# Altium project Mirny.PrjPCB (part 3 of 4)

## Sheet CLK_INPUT.SchDoc: Clock distribution
size 420 x 297 mm; Author: K.B.; CompanyName: WUT; DrawnBy: K.B.; Organization: WUT ISE; Address1: Warsaw Univeristy of Technology; Address2: Nowowiejska 15/19; DocumentNumber: 7; Revision: 1.1.4; SheetNumber: 4; SheetTotal: 10; EDA_Number: ARTIQ; Projet: ARTIQ/SINARA; ModifiedBy: -; CreateDate: XX/XX/XXXX; CheckedDate: -; Title2: and generation; DivGrp: ISE; Designer: K.B.; ModifiedDate: -; ProjectName: ARTIQ/SINARA
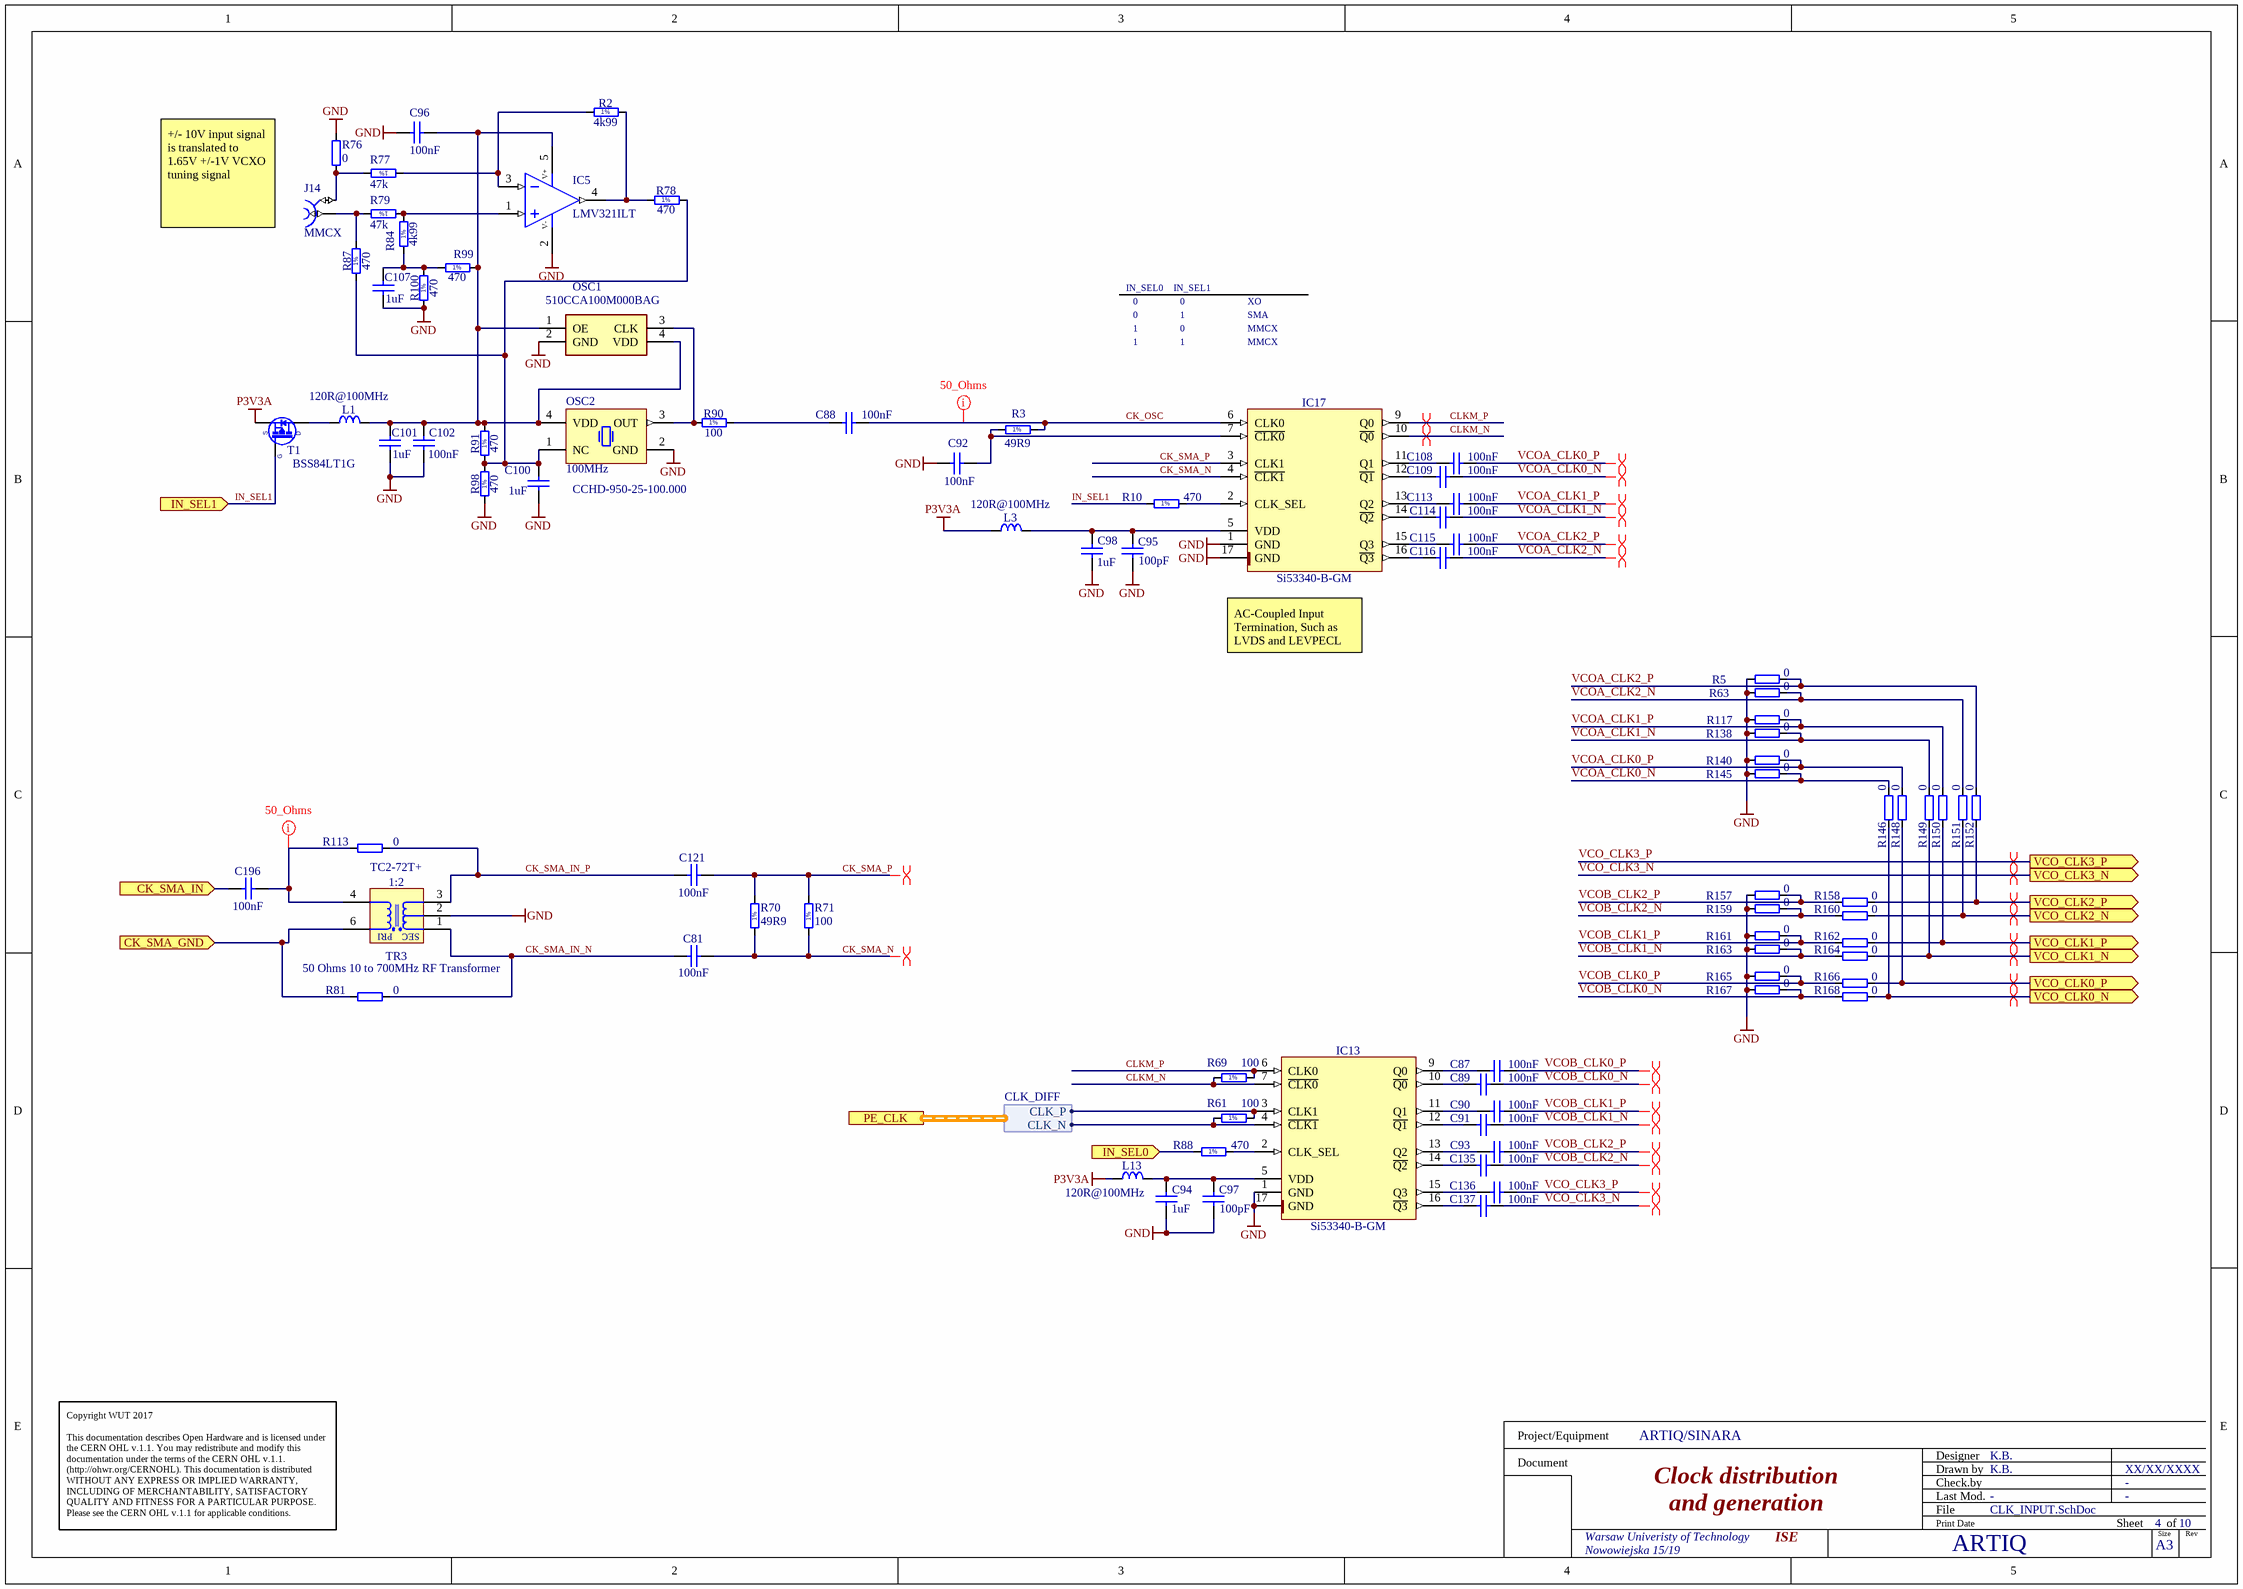
[diagram p5: CLK_INPUT.SchDoc]

### Parts
C81  100nF  [CAPC1005X55N]
C87  100nF  [CAPC1005X55N]
C88  100nF  [CAPC1005X55N]
C89  100nF  [CAPC1005X55N]
C90  100nF  [CAPC1005X55N]
C91  100nF  [CAPC1005X55N]
C92  100nF  [CAPC1005X55N]
C93  100nF  [CAPC1005X55N]
C94  1uF  [CAPC1005X55N]
C95  100pF  [CAPC1005X55N]
C96  100nF  [CAPC1005X55N]
C97  100pF  [CAPC1005X55N]
C98  1uF  [CAPC1005X55N]
C100  1uF  [CAPC1005X55N]
C101  1uF  [CAPC1005X55N]
C102  100nF  [CAPC1005X55N]
C107  1uF  [CAPC1005X55N]
C108  100nF  [CAPC1005X55N]
C109  100nF  [CAPC1005X55N]
C113  100nF  [CAPC1005X55N]
C114  100nF  [CAPC1005X55N]
C115  100nF  [CAPC1005X55N]
C116  100nF  [CAPC1005X55N]
C121  100nF  [CAPC1005X55N]
C135  100nF  [CAPC1005X55N]
C136  100nF  [CAPC1005X55N]
C137  100nF  [CAPC1005X55N]
C196  100nF  [CAPC1005X55N]
IC5  LMV321ILT  [SOT95P280X145-5N]
IC13  Si53340-B-GM  [QFN50P300X300X90-17N-S175]
IC17  Si53340-B-GM  [QFN50P300X300X90-17N-S175]
J14  MMCX  [SAMTEC_MMCX-J-P-H-ST-TH1]
L1  120R@100MHz  [INDC1608X95N]
L3  120R@100MHz  [INDC1608X95N]
L13  120R@100MHz  [INDC1608X95N]
OSC1  510CCA100M000BAG  [510CBA49M1520BAG]
OSC2  100MHz  Manufacturer Part Number: CCHD-950-25-100.000  [OSC_CRYSTEK_CCHD-950]
R2  4k99  [RESC1608X55N]
R3  49R9  [RESC1005X40N]
R5  0  [RESC1005X40N]
R10  470  [RESC1005X40N]
R61  100  [RESC1005X40N]
R63  0  [RESC1005X40N]
R69  100  [RESC1005X40N]
R70  49R9  [RESC1005X40N]
R71  100  [RESC1005X40N]
R76  0  [RESC1005X40N]
R77  47k  [RESC1608X55N]
R78  470  [RESC1608X55N]
R79  47k  [RESC1608X55N]
R81  0  [RESC1005X40N]
R84  4k99  [RESC1608X55N]
R87  470  [RESC1608X55N]
R88  470  [RESC1005X40N]
R90  100  [RESC1005X40N]
R91  470  [RESC1608X55N]
R98  470  [RESC1608X55N]
R99  470  [RESC1608X55N]
R100  470  [RESC1608X55N]
R113  0  [RESC1005X40N]
R117  0  [RESC1005X40N]
R138  0  [RESC1005X40N]
R140  0  [RESC1005X40N]
R145  0  [RESC1005X40N]
R146  0  [RESC1005X40N]
R148  0  [RESC1005X40N]
R149  0  [RESC1005X40N]
R150  0  [RESC1005X40N]
R151  0  [RESC1005X40N]
R152  0  [RESC1005X40N]
R157  0  [RESC1005X40N]
R158  0  [RESC1005X40N]
R159  0  [RESC1005X40N]
R160  0  [RESC1005X40N]
R161  0  [RESC1005X40N]
R162  0  [RESC1005X40N]
R163  0  [RESC1005X40N]
R164  0  [RESC1005X40N]
R165  0  [RESC1005X40N]
R166  0  [RESC1005X40N]
R167  0  [RESC1005X40N]
R168  0  [RESC1005X40N]
T1  BSS84LT1G  [SOT95P240X110-3N]
TR3  1:2  Manufacturer Part Number: TC2-72T+  Part Description: 50 Ohms 10 to 700MHz RF Transformer  [XFMR_MINI-CIRCUITS_AT1521]

### Ports
CK_SMA_GND (in), CK_SMA_IN (in), IN_SEL0 (in), IN_SEL1 (in), PE_CLK (harness CLK_DIFF), VCO_CLK0_N (out), VCO_CLK0_P (out), VCO_CLK1_N (out), VCO_CLK1_P (out), VCO_CLK2_N (out), VCO_CLK2_P (out), VCO_CLK3_N (out), VCO_CLK3_P (out)

### Harnesses
CLK_DIFF: CLK_N, CLK_P

### Nets
GND: C92.1 C94.1 C95.1 C96.1 C97.1 C98.1 C100.1 C101.1 C102.1 C107.1 IC5.2(V-) IC13.1(GND) IC13.17(GND) IC17.1(GND) IC17.17(GND) OSC1.2(GND) OSC2.2(GND) R5.1 R63.1 R76.2 R98.1 R100.1 R117.1 R138.1 R140.1 R145.1 R157.1 R159.1 R161.1 R163.1 R165.1 R167.1 TR3.2(NC)
P3V3A: L3.2 L13.2 T1.2(S)
CK_OSC: C88.2 IC17.6(CLK0) R3.2
CK_SMA_IN_N: C81.1 R81.2 TR3.1(SDOT)
CK_SMA_IN_P: C121.1 R113.2 TR3.3(S)
CK_SMA_N: C81.2 IC17.4(~{CLK1}) R70.1 R71.1
CK_SMA_P: C121.2 IC17.3(CLK1) R70.2 R71.2
CLKM_N: IC13.7(~{CLK0}) IC17.10(~{Q0}) R69.1
CLKM_P: IC13.6(CLK0) IC17.9(Q0) R69.2
IN_SEL0: R88.1 ; port IN_SEL0
IN_SEL1: R10.1 T1.1(G) ; port IN_SEL1
SG0: R81.1 TR3.6(PDOT) ; port CK_SMA_GND
VCO_CLK0_N: R146.1 R168.2 ; port VCO_CLK0_N
VCO_CLK0_P: R148.1 R166.2 ; port VCO_CLK0_P
VCO_CLK1_N: R149.1 R164.2 ; port VCO_CLK1_N
VCO_CLK1_P: R150.1 R162.2 ; port VCO_CLK1_P
VCO_CLK2_N: R151.1 R160.2 ; port VCO_CLK2_N
VCO_CLK2_P: R152.1 R158.2 ; port VCO_CLK2_P
VCO_CLK3_N: C137.1 ; port VCO_CLK3_N
VCO_CLK3_P: C136.1 ; port VCO_CLK3_P
VCOA_CLK0_N: C109.1 R145.2 R146.2
VCOA_CLK0_P: C108.1 R140.2 R148.2
VCOA_CLK1_N: C114.1 R138.2 R149.2
VCOA_CLK1_P: C113.1 R117.2 R150.2
VCOA_CLK2_N: C116.1 R63.2 R151.2
VCOA_CLK2_P: C115.1 R5.2 R152.2
VCOB_CLK0_N: C89.1 R167.2 R168.1
VCOB_CLK0_P: C87.1 R165.2 R166.1
VCOB_CLK1_N: C91.1 R163.2 R164.1
VCOB_CLK1_P: C90.1 R161.2 R162.1
VCOB_CLK2_N: C135.1 R159.2 R160.1
VCOB_CLK2_P: C93.1 R157.2 R158.1
NetC87_2: C87.2 IC13.9(Q0)
NetC88_1: C88.1 R90.2
NetC89_2: C89.2 IC13.10(~{Q0})
NetC90_2: C90.2 IC13.11(Q1)
NetC91_2: C91.2 IC13.12(~{Q1})
NetC92_2: C92.2 IC17.7(~{CLK0}) R3.1
NetC93_2: C93.2 IC13.13(Q2)
NetC94_2: C94.2 C97.2 IC13.5(VDD) L13.1
NetC95_2: C95.2 C98.2 IC17.5(VDD) L3.1
NetC96_2: C96.2 C101.2 C102.2 IC5.5(V+) L1.1 OSC1.1(OE) OSC1.4(VDD) OSC2.4(VDD) R91.2 R99.2
NetC100_2: C100.2 OSC2.1(NC) R78.2 R87.1 R91.1 R98.2
NetC107_2: C107.2 R84.1 R99.1 R100.2
NetC108_2: C108.2 IC17.11(Q1)
NetC109_2: C109.2 IC17.12(~{Q1})
NetC113_2: C113.2 IC17.13(Q2)
NetC114_2: C114.2 IC17.14(~{Q2})
NetC115_2: C115.2 IC17.15(Q3)
NetC116_2: C116.2 IC17.16(~{Q3})
NetC135_2: C135.2 IC13.14(~{Q2})
NetC136_2: C136.2 IC13.15(Q3)
NetC137_2: C137.2 IC13.16(~{Q3})
NetC196_1: C196.1 ; port CK_SMA_IN
NetC196_2: C196.2 R113.1 TR3.4(P)
NetIC5_1: IC5.1(IN+) R79.1 R84.2
NetIC5_3: IC5.3(IN-) R2.1 R77.1
NetIC5_4: IC5.4(OUT) R2.2 R78.1
NetIC13_2: IC13.2(CLK_SEL) R88.2
NetIC13_3: IC13.3(CLK1) R61.2 ; port PE_CLK.CLK_P
NetIC13_4: IC13.4(~{CLK1}) R61.1 ; port PE_CLK.CLK_N
NetIC17_2: IC17.2(CLK_SEL) R10.2
NetJ14_1: J14.1 R79.2 R87.2
NetJ14_2: J14.2 R76.1 R77.2
NetL1_2: L1.2 T1.3(D)
NetOSC1_3: OSC1.3(CLK) OSC2.3(OUT) R90.1

### Layout directives
net class 50_Ohms: CK_OSC, NetC196_2
differential pair: CK_SMA_N, CK_SMA_P, CLKM_N, CLKM_P, VCO_CLK0_N, VCO_CLK0_P, VCO_CLK1_N, VCO_CLK1_P, VCO_CLK2_N, VCO_CLK2_P, VCO_CLK3_N, VCO_CLK3_P, VCOA_CLK0_N, VCOA_CLK0_P, VCOA_CLK1_N, VCOA_CLK1_P, VCOA_CLK2_N, VCOA_CLK2_P, VCOB_CLK0_N, VCOB_CLK0_P, VCOB_CLK1_N, VCOB_CLK1_P, VCOB_CLK2_N, VCOB_CLK2_P

### Notes on the sheet
- (near J14) +/- 10V input signal is translated to 1.65V +/-1V VCXO tuning signal
- IN_SEL0
- 0
- IN_SEL1
- 1
- XO
- SMA
- MMCX
- (near IC17) AC-Coupled Input Termination, Such as LVDS and LEVPECL
- Copyright WUT 2017
  This documentation describes Open Hardware and is licensed under the CERN OHL v.1.1. You may redistribute and modify this documentation under the terms of the CERN OHL v.1.1. (http://ohwr.org/CERNOHL). This documentation is distributed WITHOUT ANY EXPRESS OR IMPLIED WARRANTY, INCLUDING OF MERCHANTABILITY, SATISFACTORY QUALITY AND FITNESS FOR A PARTICULAR PURPOSE. Please see the CERN OHL v.1.1 for applicable conditions.
- Project/Equipment
- Document
- Designer
- Drawn by
- Check.by
- File
- Last Mod.
- Print Date
- Sheet
- Size
- A3
- of
- Rev
- (in symbol R0402_49R9_1%_0.0625W_100PPM) 1%
- (in symbol R0402_100R_1%_0.0625W_100PPM) 1%
- (in symbol R0402_470R_1%_0.0625W_100PPM) 1%
- (in symbol R0603_4K99_1%_0.063W_50PPM) 1%
- (in symbol R0603_47K_1%_0.1W_100PPM) 1%
- (in symbol R0603_470R_1%_0.1W_100PPM) 1%
- (in symbol XFMR_MINI-CIRCUITS_TC2-72T+) PRI; SEC

### Library data of the parts
C81 C87-C93 C96 C102 C108 C109 C113-C116 C121 C135-C137 C196 = CC0402_100NF_16V_10%_X5R: Non-polarised capacitor; Part Description: SMD Multilayer Chip Ceramic Capacitor; Manufacturer: GENERIC; Manufacturer1 Part Number: GRM155R61C104KA88D; Voltage: 16V; TC: X5R; Tolerance: ±10%; Part Number: CC0402_100NF_16V_10%_X5R; Component Kind: Standard; Component Type: Standard; Pin Count: 2; Value: 100nF; Status: None; Manufacturer Part Number: CC0402_100NF_16V_10%_X5R; Case: 0402; Mounted: Yes; Socket: No; SMD: Yes; Sense: No; Manufacturer1 Example: MURATA; Manufacturer1 ComponentHeight: 0.55mm; HelpURL: \\cern.ch\dfs\Applications\Altium\Datasheets\CC0402_X5R_MURATA_GRM.pdf; Author: CERN DEM JLC; CreateDate: 10.12.2013; LatestRevisionDate: 10.12.2013
C94 C98 C100 C101 C107 = CC0402_1UF_16V_10%_X5R: Non-polarised capacitor; Part Description: SMD Multilayer Chip Ceramic Capacitor; Manufacturer: GENERIC; Manufacturer1 Part Number: C1005X5R1C105KT; Voltage: 16V; TC: X5R; Tolerance: ±10%; Part Number: CC0402_1UF_16V_10%_X5R; Component Kind: Standard; Component Type: Standard; Pin Count: 2; Value: 1uF; Status: Preferred; Manufacturer Part Number: CC0402_1UF_16V_10%_X5R; Case: 0402; Mounted: Yes; Socket: No; SMD: Yes; Sense: No; Manufacturer1 Example: TDK; Manufacturer1 ComponentHeight: 0.55mm; HelpURL: \\cern.ch\dfs\Applications\Altium\Datasheets\CC0402_X5R_TDK_C.pdf; Author: CERN DEM JLC; CreateDate: 2012-10-25; LatestRevisionDate: 2012-10-25
C95 C97 = CC0402_100PF_50V_5%_C0G: Non-polarised capacitor; Part Description: SMD Multilayer Chip Ceramic Capacitor; Manufacturer: GENERIC; Manufacturer1 Part Number: C0402C101J5GACTU; Voltage: 50V; TC: C0G/NP0; Tolerance: ±5%; Part Number: CC0402_100PF_50V_5%_C0G; Component Kind: Standard; Component Type: Standard; Pin Count: 2; Value: 100pF; Status: Preferred; Manufacturer Part Number: CC0402_100PF_50V_5%_C0G; Case: 0402; Mounted: Yes; Socket: No; SMD: Yes; Sense: No; Manufacturer1 Example: KEMET; Manufacturer1 ComponentHeight: 0.55mm; HelpURL: \\cern.ch\dfs\Applications\Altium\Datasheets\CC0805_C0G_KEMET_(Commercial Grade).pdf; Author: CERN DEM JLC; CreateDate: 03.12.2007; LatestRevisionDate: 22.04.2015
IC5 = LMV321ILT: Operational Amplifier; Part Description: Low Cost, Low Power, Input/Output Rail-To-Rail Operational Amplifiers; Manufacturer: ST MICROELECTRONICS; PressFit: No; Bonding: No; Part Number: LMV321ILT; Component Kind: Standard; Component Type: Standard; Device: LMV321ILT; PackageDescription: SOT, 0.95mm pitch; 5 pin, 1.60mm W X 2.90mm L X 1.45mm H body, IPC Medium Density; Manufacturer Part Number: LMV321ILT; Pin Count: 5; Case: SOT23-5; Mounted: Yes; Socket: No; SMD: Yes; Sense: No; ComponentHeight: 1.45mm; Author: CERN DEM MR; HelpURL: \\cern.ch\dfs\Applications\Altium\Datasheets\LMV321ILT.pdf; CreateDate: 02/10/2017; LatestRevisionDate: 02/10/2017
IC13 IC17 = Si53340-B-GM: Low-Jitter LVDS Fanout Clock Buffers, 10-Output,  Any-Input, Any-Frequency up to 1250MHz; Manufacturer: SILICON LABS; PressFit: No; Bonding: No; Part Number: Si53340-B-GM; Component Kind: Standard; Component Type: Standard; Device: Si53340-B-GM; PackageDescription: QFN, 0.50mm Pitch, Square; 16 Pin, 3.00mm L X 3.00mm W X 0.90mm H Body (w/thermal tab 1.75mm x 1.75mm), IPC Medium Density; Part Description: Low-Jitter LVDS Fanout Clock Buffers, 10-Output,  Any-Input, Any-Frequency up to 1250MHz; Manufacturer Part Number: Si53340-B-GM; Pin Count: 17; Case: QFN16; Mounted: Yes; Socket: No; SMD: Yes; Sense: No; ComponentHeight: 0.9mm; HelpURL: \\cern.ch\dfs\Applications\Altium\Datasheets\Si53340-B-GM.pdf; Author: CERN DEM MR; CreateDate: 04.09.2017; LatestRevisionDate: 04.09.2017
J14 = SAMTEC_MMCX-J-P-H-ST-TH1: Part Description: Straight Through-hole 50 Ohm Micro Mini RF Jack, MMCX Series; Manufacturer: SAMTEC; PressFit: No; Part Number: SAMTEC_MMCX-J-P-H-ST-TH1; Component Kind: Standard; Component Type: Standard; Pin Count: 2; Mounted: Yes; Socket: No; Sense: No; SMD: No; Status: None; Manufacturer Part Number: MMCX-J-P-H-ST-TH1; ComponentHeight: 4.35mm; HelpURL: \\cern.ch\dfs\Applications\Altium\Datasheets\SAMTEC_MMCX-J-P-H-ST-TH1.pdf; Author: CERN DEM JLC; CreateDate: 05.12.2012; LatestRevisionDate: 05.12.2012
L1 L3 L13 = IND0603_MURATA_BLM18PG121SN1D: Inductor; Part Description: SMD EMIFIL Chip Ferrite Bead; Manufacturer: MURATA; Power: 2A; Resistance: 0.05R; Part Number: IND0603_MURATA_BLM18PG121SN1D; Component Kind: Standard; Component Type: Standard; Pin Count: 2; Value: 120R@100MHz; Status: None; Manufacturer Part Number: BLM18PG121SN1D; Case: 0603; Mounted: Yes; Socket: No; SMD: Yes; Sense: No; ComponentHeight: 0.95mm; HelpURL: \\cern.ch\dfs\Applications\Altium\Datasheets\IND0603_MURATA_BLM18P.pdf; Author: CERN DEM BC; CreateDate: 2015-07-27; LatestRevisionDate: 2015-07-27
OSC1 = 510CCA100M000BAG: Crystal or Oscillator; Manufacturer_Name: Silicon Labs; Datasheet Link: https://www.silabs.com/documents/public/data-sheets/si510-11.pdf; Height: 1mm; Manufacturer_Part_Number: 510CCA100M000BAG; Mouser Part Number: 634-510CCA100M000BAG; Mouser Price/Stock: https://www.mouser.com/Search/Refine.aspx?Keyword=634-510CCA100M000BAG
OSC2 = OSC_CCHD-950: 100MHz low noise oscillator; Part Number: OSC_100MHZ_CRYSTEK_CCHD-950-25-100.000; Part Description: 3.3V, ±25ppm, 0..70°C, CMOS Surface Mount Ultra-Low Noise Oscillator (CCHD-950 Series); Manufacturer: CRYSTEK CRYSTAL; PressFit: No; Bonding: No; Component Kind: Standard; Component Type: Standard; PackageDescription: Oscillator, 5.08mm Pitch; 4 Pin, 14.2mm L X 9.14mm W X 5.3mm H, CCHD-950 Serie; Value: 100MHz; Pin Count: 4; Mounted: Yes; Socket: No; SMD: Yes; Sense: No; ComponentHeight: 5.3mm; HelpURL: \\cern.ch\dfs\Applications\Altium\Datasheets\OSC_CRYSTEK_CVHD-950.pdf; Author: GK; CreateDate: 04.11.2016; LatestRevisionDate: 04.11.2016
R2 R84 = R0603_4K99_1%_0.063W_50PPM: Resistor - 1%; Part Description: General Purpose Thick Film Chip Resistor; Manufacturer: GENERIC; Manufacturer1 Part Number: CPF0603F4K99C1; Power: 0.063W; TC: ±50ppm/°C; PressFit: No; Part Number: R0603_4K99_1%_0.063W_50PPM; Component Kind: Standard; Component Type: Standard; Pin Count: 2; Value: 4k99; Status: None; Tolerance: ±1%; Manufacturer Part Number: R0603_4K99_1%_0.063W_50PPM; Case: 0603; Mounted: Yes; Sense: No; Socket: No; SMD: Yes; Manufacturer1 Example: TYCO NEOHM; Manufacturer1 ComponentHeight: 0.55mm; HelpURL: \\cern.ch\dfs\Applications\Altium\Datasheets\R0603_TYCO_CPF.pdf; Author: CERN DEM JLC; CreateDate: 20.05.2010; LatestRevisionDate: 20.05.2010
R3 R70 = R0402_49R9_1%_0.0625W_100PPM: Resistor - 1%; Part Description: General Purpose Thick Film Chip Resistor; Manufacturer: GENERIC; Manufacturer1 Part Number: 232270674999L or RC0402FR-0749R9L; TC: ±100ppm/°C; PressFit: No; Part Number: R0402_49R9_1%_0.0625W_100PPM; Component Kind: Standard; Component Type: Standard; Pin Count: 2; Value: 49R9; Status: Not Recommended; Power: 0.0625W; Tolerance: ±1%; Manufacturer Part Number: R0402_49R9_1%_0.0625W_100PPM; Case: 0402; Mounted: Yes; Sense: No; Socket: No; SMD: Yes; Manufacturer1 Example: YAGEO PHYCOMP; Manufacturer1 ComponentHeight: 0.4mm; HelpURL: \\cern.ch\dfs\Applications\Altium\Datasheets\R0402_Phycomp_RC0402.pdf; Author: CERN DEM JLC; CreateDate: 24.10.2012; LatestRevisionDate: 24.10.2012
R5 R63 R76 R81 R113 R117 R138 R140 R145 R146 R148-R152 R157-R168 = R0402_0R_JUMPER: Resistor; Part Description: 1A (0.05R Max DC Resistance) Zero Ohm Jumper; Manufacturer: GENERIC; Manufacturer1 Part Number: 232270591001L; PressFit: No; Part Number: R0402_0R_JUMPER; Component Kind: Standard; Component Type: Standard; Pin Count: 2; Value: 0; Status: Not Recommended; Manufacturer Part Number: R0402_0R_JUMPER; Case: 0402; Mounted: Yes; Sense: No; Socket: No; SMD: Yes; Manufacturer1 Example: YAGEO PHYCOMP; Manufacturer1 ComponentHeight: 0.4mm; HelpURL: \\cern.ch\dfs\Applications\Altium\Datasheets\R0402_Phycomp_RC0402.pdf; Author: CERN DEM JLC; CreateDate: 03.12.2007; LatestRevisionDate: 17.10.2012
R10 R88 = R0402_470R_1%_0.0625W_100PPM: Resistor - 1%; Part Description: General Purpose Thick Film Chip Resistor; Manufacturer: GENERIC; Manufacturer1 Part Number: 232270674701L; TC: ±100ppm/°C; PressFit: No; Part Number: R0402_470R_1%_0.0625W_100PPM; Component Kind: Standard; Component Type: Standard; Pin Count: 2; Value: 470; Status: Not Recommended; Power: 0.0625W; Tolerance: ±1%; Manufacturer Part Number: R0402_470R_1%_0.0625W_100PPM; Case: 0402; Mounted: Yes; Sense: No; Socket: No; SMD: Yes; Manufacturer1 Example: YAGEO PHYCOMP; Manufacturer1 ComponentHeight: 0.4mm; HelpURL: \\cern.ch\dfs\Applications\Altium\Datasheets\R0402_Phycomp_RC0402.pdf; Author: CERN DEM JLC; CreateDate: 03.12.2007; LatestRevisionDate: 17.10.2012
R61 R69 R71 R90 = R0402_100R_1%_0.0625W_100PPM: Resistor - 1%; Part Description: General Purpose Thick Film Chip Resistor; Manufacturer: GENERIC; Manufacturer1 Part Number: 232270671001L; TC: ±100ppm/°C; PressFit: No; Part Number: R0402_100R_1%_0.0625W_100PPM; Component Kind: Standard; Component Type: Standard; Pin Count: 2; Value: 100; Status: Not Recommended; Power: 0.0625W; Tolerance: ±1%; Manufacturer Part Number: R0402_100R_1%_0.0625W_100PPM; Case: 0402; Mounted: Yes; Sense: No; Socket: No; SMD: Yes; Manufacturer1 Example: YAGEO PHYCOMP; Manufacturer1 ComponentHeight: 0.4mm; HelpURL: \\cern.ch\dfs\Applications\Altium\Datasheets\R0402_Phycomp_RC0402.pdf; Author: CERN DEM JLC; CreateDate: 03.12.2007; LatestRevisionDate: 17.10.2012
R77 R79 = R0603_47K_1%_0.1W_100PPM: Resistor - 1%; Part Description: General Purpose Thick Film Chip Resistor; Manufacturer: GENERIC; Manufacturer1 Part Number: NRC06F4702TRF; Power: 0.1W; TC: ±100ppm/°C; Part Number: R0603_47K_1%_0.1W_100PPM; Component Kind: Standard; Component Type: Standard; Pin Count: 2; Value: 47k; Status: Preferred; Tolerance: ±1%; Manufacturer Part Number: R0603_47K_1%_0.1W_100PPM; Case: 0603; Mounted: Yes; Sense: No; Socket: No; SMD: Yes; Manufacturer1 Example: NIC COMPONENT; Manufacturer1 ComponentHeight: 0.55mm; HelpURL: \\cern.ch\dfs\Applications\Altium\Datasheets\R0603_NIC_NRC.pdf; Author: CERN DEM JLC; CreateDate: 03.12.2007; LatestRevisionDate: 13.03.2008
R78 R87 R91 R98-R100 = R0603_470R_1%_0.1W_100PPM: Resistor - 1%; Part Description: General Purpose Thick Film Chip Resistor; Manufacturer: GENERIC; Manufacturer1 Part Number: NRC06F4700TRF; Power: 0.1W; TC: ±100ppm/°C; PressFit: No; Part Number: R0603_470R_1%_0.1W_100PPM; Component Kind: Standard; Component Type: Standard; Pin Count: 2; Value: 470; Status: Preferred; Tolerance: ±1%; Manufacturer Part Number: R0603_470R_1%_0.1W_100PPM; Case: 0603; Mounted: Yes; Sense: No; Socket: No; SMD: Yes; Manufacturer1 Example: NIC COMPONENT; Manufacturer1 ComponentHeight: 0.55mm; HelpURL: \\cern.ch\dfs\Applications\Altium\Datasheets\R0603_NIC_NRC.pdf; Author: CERN DEM JLC; CreateDate: 03.12.2007; LatestRevisionDate: 13.03.2008
T1 = BSS84LT1G: P-CHANNEL MOSFET WITH DIODE; Part Description: 50V 130mA Single P-Channel Power MOSFET; Manufacturer: ON SEMICONDUCTOR; PressFit: No; Bonding: No; Part Number: BSS84LT1G; Component Kind: Standard; Component Type: Standard; Device: BSS84LT1G; PackageDescription: SOT23 3-Leads, Pitch 0.95mm - Body 1.4x3mm, IPC Medium Density; Manufacturer Part Number: BSS84LT1G; Pin Count: 3; Case: SOT23-3; Mounted: Yes; Socket: No; SMD: Yes; Sense: No; ComponentHeight: 1.1mm; HelpURL: \\cern.ch\dfs\Applications\Altium\Datasheets\BSS84LT1G.pdf; Author: CERN DEM JLC; CreateDate: 29.03.2012; LatestRevisionDate: 29.03.2012
TR3 = XFMR_MINI-CIRCUITS_TC2-72T+: 50 Ohms 10 to 700 MHzz RF Transformer; Manufacturer: MINI-CIRCUITS; HelpURL: \\cern.ch\dfs\Applications\Altium\Datasheets\XFMR_MINI-CIRCUITS_TC2-1TX+.pdf; Part Number: XFMR_MINI-CIRCUITS_TC2-72T+; Component Kind: Standard; Component Type: Standard; Pin Count: 5; Value: 1:2; Status: None; Mounted: Yes; Socket: No; Sense: No; SMD: Yes; ComponentHeight: 4.06mm; Author: GK; CreateDate: 18.10.2019; LatestRevisionDate: 18.10.2019

## Sheet B2B_connectors.SchDoc: AFE Mezzanine
size 420 x 297 mm; Author: K.B.; CompanyName: WUT; DrawnBy: K.B.; Organization: WUT ISE; Address1: Warsaw Univeristy of Technology; Address2: Nowowiejska 15/19; DocumentNumber: 8; Revision: 1.1.4; SheetNumber: 6; SheetTotal: 12; EDA_Number: ARTIQ; Projet: ARTIQ/SINARA; ModifiedBy: -; CreateDate: XX/XX/XXXX; CheckedDate: -; Title2: Connectors; DivGrp: ISE; Designer: K.B.; ModifiedDate: -; ProjectName: ARTIQ/SINARA
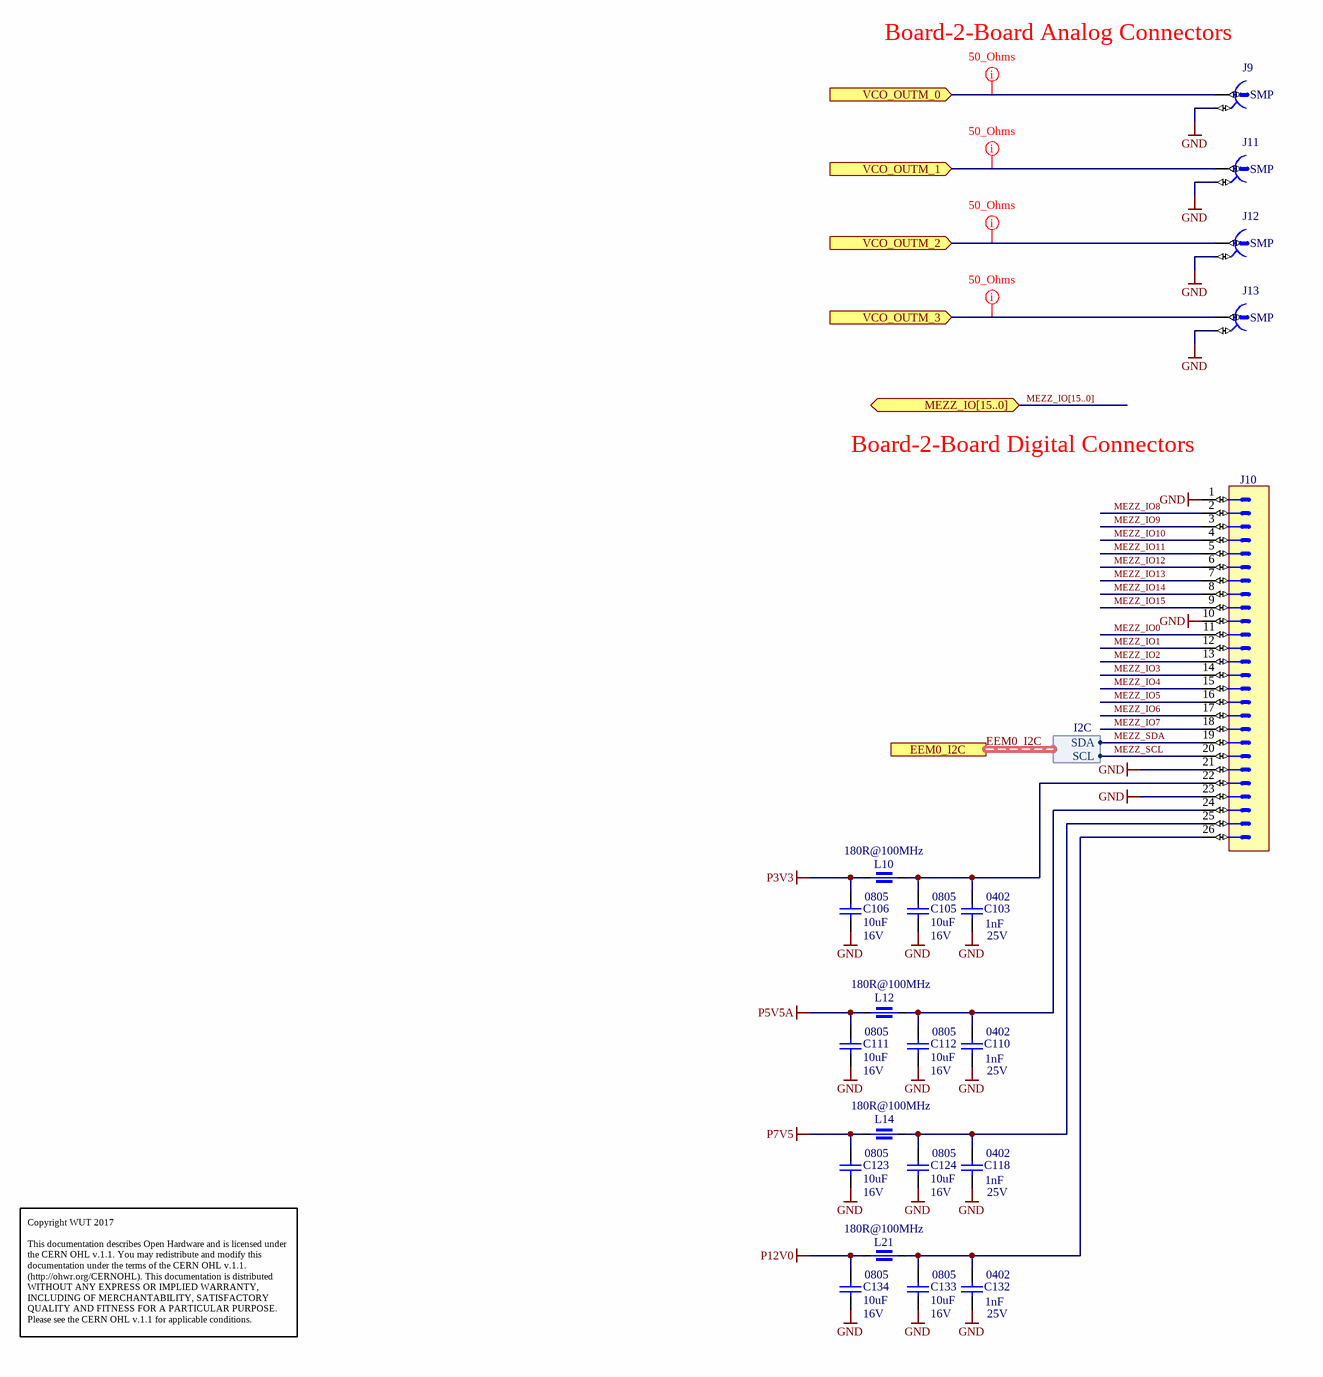
[diagram p6: B2B_connectors.SchDoc]

### Parts
C103  1nF  Voltage: 25V  Case: 0402  [CAPC1005X55N]
C105  10uF  Voltage: 16V  Case: 0805  [CAPC2012X135N]
C106  10uF  Voltage: 16V  Case: 0805  [CAPC2012X135N]
C110  1nF  Voltage: 25V  Case: 0402  [CAPC1005X55N]
C111  10uF  Voltage: 16V  Case: 0805  [CAPC2012X135N]
C112  10uF  Voltage: 16V  Case: 0805  [CAPC2012X135N]
C118  1nF  Voltage: 25V  Case: 0402  [CAPC1005X55N]
C123  10uF  Voltage: 16V  Case: 0805  [CAPC2012X135N]
C124  10uF  Voltage: 16V  Case: 0805  [CAPC2012X135N]
C132  1nF  Voltage: 25V  Case: 0402  [CAPC1005X55N]
C133  10uF  Voltage: 16V  Case: 0805  [CAPC2012X135N]
C134  10uF  Voltage: 16V  Case: 0805  [CAPC2012X135N]
J9  SMP  [MOLEX_85305-0232]
J10  Header 26  [3M_N2526-6002RB]  (value not drawn)
J11  SMP  [MOLEX_85305-0232]
J12  SMP  [MOLEX_85305-0232]
J13  SMP  [MOLEX_85305-0232]
L10  180R@100MHz  [INDC4516X180N]
L12  180R@100MHz  [INDC4516X180N]
L14  180R@100MHz  [INDC4516X180N]
L21  180R@100MHz  [INDC4516X180N]

### Ports
EEM0_I2C (harness I2C), MEZZ_IO[15..0] (bidir), VCO_OUTM_0 (in), VCO_OUTM_1 (in), VCO_OUTM_2 (in), VCO_OUTM_3 (in)

### Harnesses
I2C: SDA, SCL

### Nets
GND: C103.1 C105.1 C106.1 C110.1 C111.1 C112.1 C118.1 C123.1 C124.1 C132.1 C133.1 C134.1 J9.2 J10.1 J10.10 J10.21 J10.23 J11.2 J12.2 J13.2
P3V3: C106.2 L10.2
P5V5A: C111.2 L12.1
P7V5: C123.2 L14.1
P12V0: C134.2 L21.2
MEZZ_IO0: J10.11
MEZZ_IO1: J10.12
MEZZ_IO2: J10.13
MEZZ_IO3: J10.14
MEZZ_IO4: J10.15
MEZZ_IO5: J10.16
MEZZ_IO6: J10.17
MEZZ_IO7: J10.18
MEZZ_IO8: J10.2
MEZZ_IO9: J10.3
MEZZ_IO10: J10.4
MEZZ_IO11: J10.5
MEZZ_IO12: J10.6
MEZZ_IO13: J10.7
MEZZ_IO14: J10.8
MEZZ_IO15: J10.9
MEZZ_SCL: J10.20 ; port EEM0_I2C.SCL  [project net EEM0_I2C.SCL]
MEZZ_SDA: J10.19 ; port EEM0_I2C.SDA  [project net EEM0_I2C.SDA]
VCO_OUTM: J9.1 ; port VCO_OUTM_0
VCO_OUTM: J11.1 ; port VCO_OUTM_1  [a separate net that carries the same name]
VCO_OUTM: J12.1 ; port VCO_OUTM_2  [a separate net that carries the same name]
VCO_OUTM: J13.1 ; port VCO_OUTM_3  [a separate net that carries the same name]
NetC103_2: C103.2 C105.2 J10.22 L10.1
NetC110_2: C110.2 C112.2 J10.24 L12.2
NetC118_2: C118.2 C124.2 J10.25 L14.2
NetC132_2: C132.2 C133.2 J10.26 L21.1

### Buses and harness runs
bus MEZZ_IO[15..0] = port MEZZ_IO[15..0]
harness EEM0_I2C = port EEM0_I2C

### Layout directives
net class 50_Ohms: VCO_OUTM

### Notes on the sheet
- (near J9) Board-2-Board Analog Connectors
- (near J10) Board-2-Board Digital Connectors
- Copyright WUT 2017
  This documentation describes Open Hardware and is licensed under the CERN OHL v.1.1. You may redistribute and modify this documentation under the terms of the CERN OHL v.1.1. (http://ohwr.org/CERNOHL). This documentation is distributed WITHOUT ANY EXPRESS OR IMPLIED WARRANTY, INCLUDING OF MERCHANTABILITY, SATISFACTORY QUALITY AND FITNESS FOR A PARTICULAR PURPOSE. Please see the CERN OHL v.1.1 for applicable conditions.
- Project/Equipment
- Document
- Designer
- Drawn by
- Check.by
- File
- Last Mod.
- Print Date
- Sheet
- Size
- A3
- of
- Rev

### Library data of the parts
C103 C110 C118 C132 = CC0402_1NF_50V_10%_X7R: Non-polarised capacitor; Part Number: CC0402_1NF_25V_5%_NP0; Part Description: SMD Multilayer Chip Ceramic Capacitor; Manufacturer: GENERIC; Manufacturer1 Part Number: C1005C0G1E102J050BA; TC: NP0; Tolerance: ±5%; Component Kind: Standard; Component Type: Standard; Pin Count: 2; Value: 1nF; Status: Not Recommended; Manufacturer Part Number: CC0402_1NF_25V_5%_NP0; Mounted: Yes; Socket: No; SMD: Yes; Sense: No; Manufacturer1 Example: TDK; Manufacturer1 ComponentHeight: 0.55mm; HelpURL: \\cern.ch\dfs\Applications\Altium\Datasheets\CC0402_X7R_PHYCOMP.pdf; Author: CERN DEM JLC; CreateDate: 03.12.2007; LatestRevisionDate: 03.12.2007
C105 C106 C111 C112 C123 C124 C133 C134 = CC0805_22UF_16V_10%_X5R: Non-polarised capacitor; Part Number: CC0805_10UF_16V_10%_X7R; Part Description: SMD Multilayer Chip Ceramic Capacitor; Manufacturer: GENERIC; Manufacturer1 Part Number: CL21B106KOQNNN; TC: X7R; Tolerance: ±10%; Component Kind: Standard; Component Type: Standard; Pin Count: 2; Value: 10uF; Status: Preferred; Manufacturer Part Number: CC0805_10UF_16V_10%_X7R; Mounted: Yes; Socket: No; SMD: Yes; Sense: No; Manufacturer1 Example: SAMSUNG; Manufacturer1 ComponentHeight: 1.35mm; HelpURL: \\cern.ch\dfs\Applications\Altium\Datasheets\CC0805_X5R_TDK_C.pdf; Author: CERN DEM JLC; CreateDate: 25.10.2012; LatestRevisionDate: 25.10.2012
J9 J11-J13 = MOLEX_85305-0232: Part Description: 50 Ohms, SMP Surface Mount Plug, Limited Detent; Manufacturer: MOLEX; PressFit: No; Part Number: MOLEX_85305-0232; Component Kind: Standard; Component Type: Standard; Pin Count: 2; Family: SMP; Mounted: Yes; Socket: No; SMD: Yes; Sense: No; Status: None; Manufacturer Part Number: 85305-0232; ComponentHeight: 4.1mm; HelpURL: \\cern.ch\dfs\Applications\Altium\Datasheets\MOLEX_85305-0232.pdf; Author: CERN DEM JMW; CreateDate: 09.08.2016; LatestRevisionDate: 09.08.2016
J10 = 3M_N2526-6002RB: Connector 26 Male; Part Description: 26 Contacts - Straight .100'' x .100'' Low Profile Four-Wall Header, 2500 Series; Manufacturer: 3M; PressFit: No; Part Number: 3M_N2526-6002RB; Component Kind: Standard; Component Type: Standard; Pin Count: 26; Family: Header 26; Mounted: Yes; Socket: No; SMD: No; Sense: No; Status: None; Manufacturer Part Number: N2526-6002RB; ComponentHeight: 10.03mm; HelpURL: \\cern.ch\dfs\Applications\Altium\Datasheets\3M_N2526-6002RB.pdf; Author: CERN DEM JLC; CreateDate: 11.02.2009; LatestRevisionDate: 11.08.2009
L10 L12 L14 L21 = IND1806_MURATA_BLM41PG181SN1L: Part Description: SMD EMI Suppression Chip Ferrite Bead (BLM41P Series); Manufacturer: MURATA; Power: 3.5A; Resistance: 0.02R; Part Number: IND1806_MURATA_BLM41PG181SN1L; Component Kind: Standard; Component Type: Standard; Pin Count: 2; Value: 180R@100MHz; Status: None; Manufacturer Part Number: BLM41PG181SN1L; Case: 1806; Mounted: Yes; Socket: No; SMD: Yes; Sense: No; ComponentHeight: 1.8mm; HelpURL: \\cern.ch\dfs\Applications\Altium\Datasheets\IND1806_MURATA_BLM41P.pdf; Author: CERN DEM JLC; CreateDate: 26.06.2012; LatestRevisionDate: 26.06.2012

## Sheet LVDS_IFC_VCO.SchDoc: LVDS to LVTTL
size 420 x 297 mm; Author: K.B.; CompanyName: WUT; DrawnBy: K.B.; Organization: WUT ISE; Address1: Warsaw Univeristy of Technology; Address2: Nowowiejska 15/19; DocumentNumber: 5; Revision: 1.1.4; SheetNumber: 5; SheetTotal: 10; EDA_Number: ARTIQ; Projet: ARTIQ/SINARA; ModifiedBy: -; CreateDate: XX/XX/XXXX; CheckedDate: -; Title2: interface & EEM connector; DivGrp: ISE; Designer: K.B.; ModifiedDate: -; ProjectName: ARTIQ/SINARA
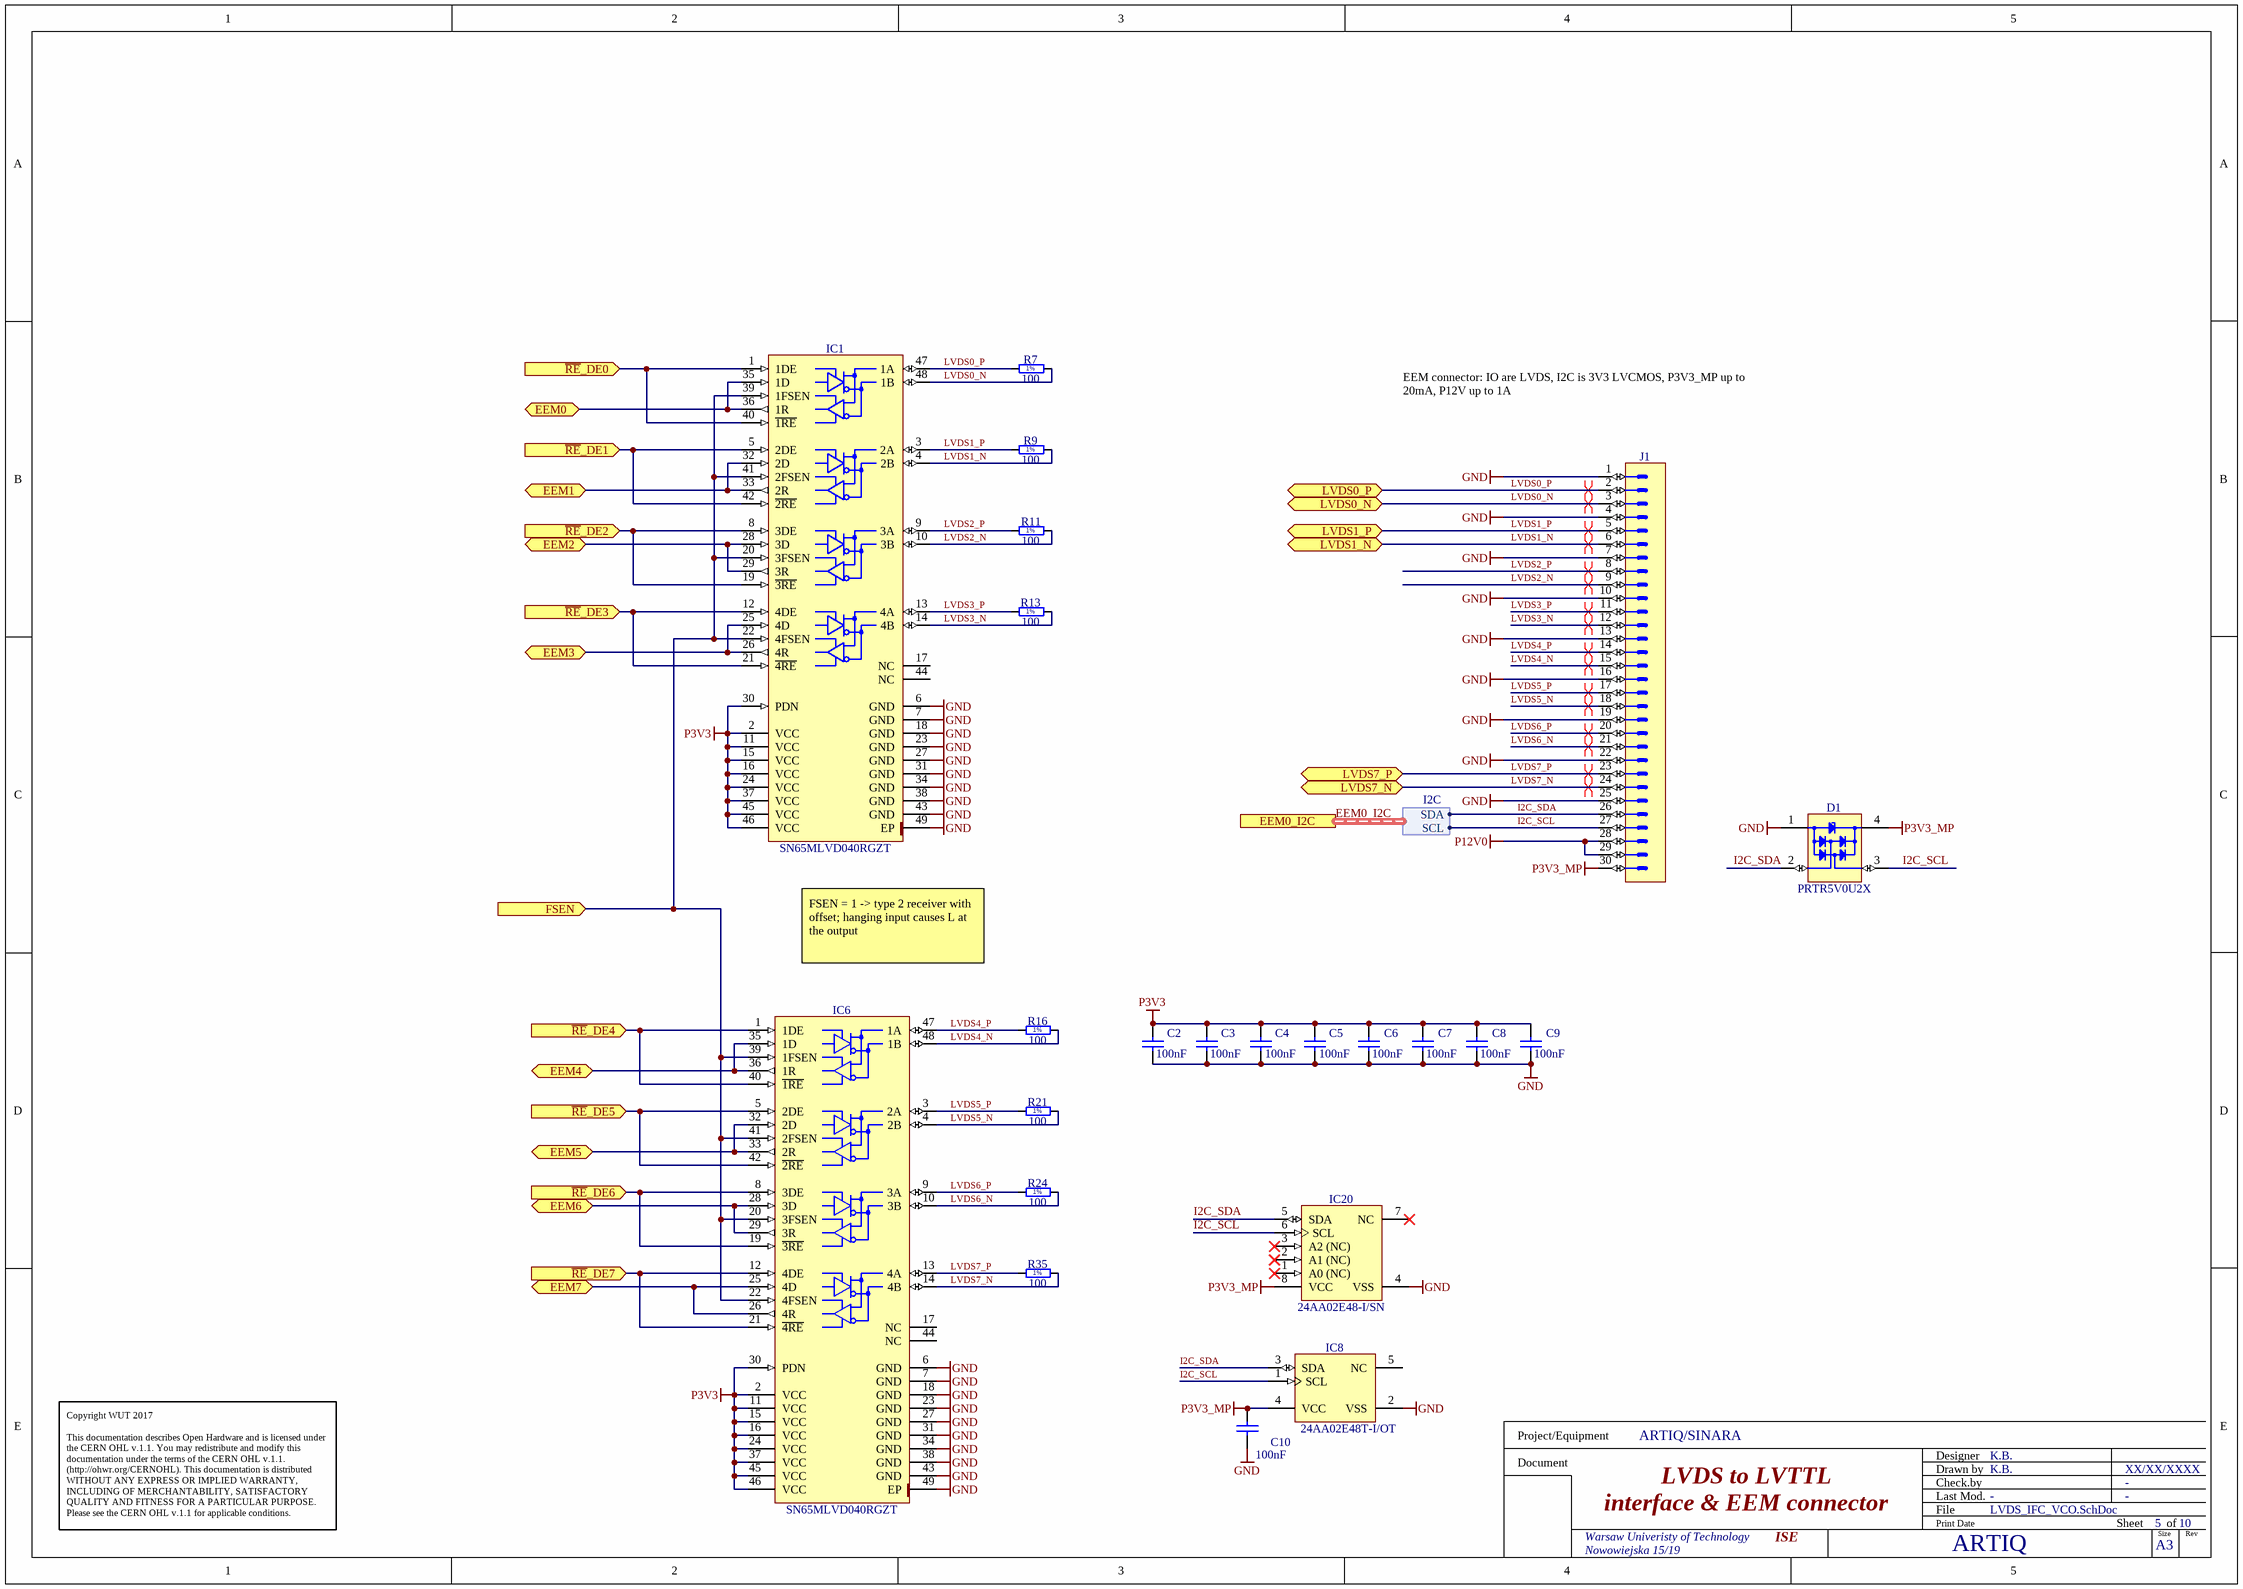
[diagram p7: LVDS_IFC_VCO.SchDoc]

### Parts
(Parts that share a designator on the sheet are numbered #1, #2 ... from top to bottom, then left to right.)
C2  100nF  [CAPC1005X55N]
C3  100nF  [CAPC1005X55N]
C4  100nF  [CAPC1005X55N]
C5  100nF  [CAPC1005X55N]
C6  100nF  [CAPC1005X55N]
C7  100nF  [CAPC1005X55N]
C8  100nF  [CAPC1005X55N]
C9  100nF  [CAPC1005X55N]
C10  100nF  [CAPC1005X55N]
D1  PRTR5V0U2X  [SOT190P230X110-4N]
IC1  SN65MLVD040RGZT  [QFN50P700X700X100-49N-S420]
IC6  SN65MLVD040RGZT  [QFN50P700X700X100-49N-S420]
IC8  24AA02E48T-I/OT  [SOT95P280X145-5N]
IC20  24AA02E48-I/SN  [SOIC127P600X175-8N]
J1  (no value)  [3M_N2530-6002RB]
R7#2  100  [RESC1005X40N]
R9#2  100  [RESC1005X40N]
R11  100  [RESC1005X40N]
R13  100  [RESC1005X40N]
R16  100  [RESC1005X40N]
R21  100  [RESC1005X40N]
R24  100  [RESC1005X40N]
R35  100  [RESC1005X40N]

### Ports
EEM0 (bidir), EEM0_I2C (harness I2C), EEM1 (bidir), EEM2 (bidir), EEM3 (bidir), EEM4 (bidir), EEM5 (bidir), EEM6 (bidir), EEM7 (bidir), FSEN (in), LVDS0_N (bidir), LVDS0_P (bidir), LVDS1_N (bidir), LVDS1_P (bidir), LVDS7_N (bidir), LVDS7_P (bidir), ~{RE}_DE0 (in), ~{RE}_DE1 (in), ~{RE}_DE2 (in), ~{RE}_DE3 (in), ~{RE}_DE4 (in), ~{RE}_DE5 (in), ~{RE}_DE6 (in), ~{RE}_DE7 (in)

### Harnesses
I2C: SDA, SCL

### Nets
GND: C2.1 C3.1 C4.1 C5.1 C6.1 C7.1 C8.1 C9.1 C10.1 D1.1(GND) IC1.6(GND) IC1.7(GND) IC1.18(GND) IC1.23(GND) IC1.27(GND) IC1.31(GND) IC1.34(GND) IC1.38(GND) IC1.43(GND) IC1.49(EP) IC6.6(GND) IC6.7(GND) IC6.18(GND) IC6.23(GND) IC6.27(GND) IC6.31(GND) IC6.34(GND) IC6.38(GND) IC6.43(GND) IC6.49(EP) IC8.2(VSS) IC20.4(VSS) J1.1 J1.4 J1.7 J1.10 J1.13 J1.16 J1.19 J1.22 J1.25
P3V3: C2.2 C3.2 C4.2 C5.2 C6.2 C7.2 C8.2 C9.2 IC1.2(VCC) IC1.11(VCC) IC1.15(VCC) IC1.16(VCC) IC1.24(VCC) IC1.30(PDN) IC1.37(VCC) IC1.45(VCC) IC1.46(VCC) IC6.2(VCC) IC6.11(VCC) IC6.15(VCC) IC6.16(VCC) IC6.24(VCC) IC6.30(PDN) IC6.37(VCC) IC6.45(VCC) IC6.46(VCC)
P3V3_MP: C10.2 D1.4(VCC) IC8.4(VCC) IC20.8(VCC) J1.30
P12V0: J1.28 J1.29
I2C_SCL: D1.3(I/O2) IC8.1(SCL) IC20.6(SCL) J1.27 ; port EEM0_I2C.SCL  [project net EEM0_I2C.SCL]
I2C_SDA: D1.2(I/O1) IC8.3(SDA) IC20.5(SDA) J1.26 ; port EEM0_I2C.SDA  [project net EEM0_I2C.SDA]
LVDS0_N: IC1.48(1B) J1.3 R7#2.2 ; port LVDS0_N
LVDS0_P: IC1.47(1A) J1.2 R7#2.1 ; port LVDS0_P
LVDS1_N: IC1.4(2B) J1.6 R9#2.2 ; port LVDS1_N
LVDS1_P: IC1.3(2A) J1.5 R9#2.1 ; port LVDS1_P
LVDS2_N: IC1.10(3B) J1.9 R11.2
LVDS2_P: IC1.9(3A) J1.8 R11.1
LVDS3_N: IC1.14(4B) J1.12 R13.2
LVDS3_P: IC1.13(4A) J1.11 R13.1
LVDS4_N: IC6.48(1B) J1.15 R16.2
LVDS4_P: IC6.47(1A) J1.14 R16.1
LVDS5_N: IC6.4(2B) J1.18 R21.2
LVDS5_P: IC6.3(2A) J1.17 R21.1
LVDS6_N: IC6.10(3B) J1.21 R24.2
LVDS6_P: IC6.9(3A) J1.20 R24.1
LVDS7_N: IC6.14(4B) J1.24 R35.2 ; port LVDS7_N
LVDS7_P: IC6.13(4A) J1.23 R35.1 ; port LVDS7_P
NetIC1_1: IC1.1(1DE) IC1.40(~{1RE}) ; port ~{RE}_DE0
NetIC1_5: IC1.5(2DE) IC1.42(~{2RE}) ; port ~{RE}_DE1
NetIC1_8: IC1.8(3DE) IC1.19(~{3RE}) ; port ~{RE}_DE2
NetIC1_12: IC1.12(4DE) IC1.21(~{4RE}) ; port ~{RE}_DE3
NetIC1_20: IC1.20(3FSEN) IC1.22(4FSEN) IC1.39(1FSEN) IC1.41(2FSEN) IC6.20(3FSEN) IC6.22(4FSEN) IC6.39(1FSEN) IC6.41(2FSEN) ; port FSEN
NetIC1_25: IC1.25(4D) IC1.26(4R) ; port EEM3
NetIC1_28: IC1.28(3D) IC1.29(3R) ; port EEM2
NetIC1_32: IC1.32(2D) IC1.33(2R) ; port EEM1
NetIC1_35: IC1.35(1D) IC1.36(1R) ; port EEM0
NetIC6_1: IC6.1(1DE) IC6.40(~{1RE}) ; port ~{RE}_DE4
NetIC6_5: IC6.5(2DE) IC6.42(~{2RE}) ; port ~{RE}_DE5
NetIC6_8: IC6.8(3DE) IC6.19(~{3RE}) ; port ~{RE}_DE6
NetIC6_12: IC6.12(4DE) IC6.21(~{4RE}) ; port ~{RE}_DE7
NetIC6_25: IC6.25(4D) IC6.26(4R) ; port EEM7
NetIC6_28: IC6.28(3D) IC6.29(3R) ; port EEM6
NetIC6_32: IC6.32(2D) IC6.33(2R) ; port EEM5
NetIC6_35: IC6.35(1D) IC6.36(1R) ; port EEM4

Not connected (* = marked no-connect by the designer): IC1 17(NC) 44(NC); IC6 17(NC) 44(NC); IC8 5(NC); IC20 1(A0_(NC))* 2(A1_(NC))* 3(A2_(NC))* 7(NC)*

### Buses and harness runs
harness EEM0_I2C = port EEM0_I2C

### Layout directives
differential pair: LVDS0_N, LVDS0_P, LVDS1_N, LVDS1_P, LVDS2_N, LVDS2_P, LVDS3_N, LVDS3_P, LVDS4_N, LVDS4_P, LVDS5_N, LVDS5_P, LVDS6_N, LVDS6_P, LVDS7_N, LVDS7_P

### Notes on the sheet
- (near J1) EEM connector: IO are LVDS, I2C is 3V3 LVCMOS, P3V3_MP up to 20mA, P12V up to 1A
- FSEN = 1 -> type 2 receiver with offset; hanging input causes L at the output
- Copyright WUT 2017
  This documentation describes Open Hardware and is licensed under the CERN OHL v.1.1. You may redistribute and modify this documentation under the terms of the CERN OHL v.1.1. (http://ohwr.org/CERNOHL). This documentation is distributed WITHOUT ANY EXPRESS OR IMPLIED WARRANTY, INCLUDING OF MERCHANTABILITY, SATISFACTORY QUALITY AND FITNESS FOR A PARTICULAR PURPOSE. Please see the CERN OHL v.1.1 for applicable conditions.
- Project/Equipment
- Document
- Designer
- Drawn by
- Check.by
- File
- Last Mod.
- Print Date
- Sheet
- Size
- A3
- of
- Rev
- (in symbol R0402_100R_1%_0.1W_100PPM) 1%

### Library data of the parts
C2-C10 = CC0402_100NF_16V_10%_X5R: as C81 on sheet CLK_INPUT; Part Number: CC0402_100NF_16V_10%_X5R; Component Kind: Standard; Component Type: Standard; Pin Count: 2; Value: 100nF; Status: None; Manufacturer Part Number: CC0402_100NF_16V_10%_X5R; Case: 0402; Mounted: Yes; Socket: No; SMD: Yes; Sense: No; Manufacturer1 Example: MURATA; Manufacturer1 ComponentHeight: 0.55mm; HelpURL: \\cern.ch\dfs\Applications\Altium\Datasheets\CC0402_X5R_MURATA_GRM.pdf; Author: CERN DEM JLC; CreateDate: 10.12.2013; LatestRevisionDate: 10.12.2013
D1 = PRTR5V0U2X: Ultra Low Capacitance Double Rail-to-Rail ESD Protection Diode; Part Description: Ultra Low Capacitance (1pF) Double Rail-to-Rail ESD Protection Diode (8kV); Manufacturer: NXP SEMICONDUCTORS; Voltage: 5.5V; PressFit: No; Bonding: No; Part Number: PRTR5V0U2X; Component Kind: Standard; Component Type: Standard; Device: PRTR5V0U2X; PackageDescription: SOT143B, SOT, 1.90mm Pitch; 4 Pin, 1.30mm W X 2.90mm L X 1.10mm H body, IPC Medium Density; Manufacturer Part Number: PRTR5V0U2X; Pin Count: 4; Case: SOT143B; Mounted: Yes; Socket: No; SMD: Yes; Sense: No; ComponentHeight: 1.1mm; HelpURL: \\cern.ch\dfs\Applications\Altium\Datasheets\PRTR5V0U2X.pdf; Author: CERN DEM JLC; CreateDate: 22.03.2011; LatestRevisionDate: 22.03.2011
IC1 IC6 = SN65MLVD040RGZT: 4-Channel Half-Duplex M-LVDS Line Transceiver; Manufacturer: TEXAS INSTRUMENTS; PressFit: No; Bonding: No; Part Number: SN65MLVD040RGZT; Component Kind: Standard; Component Type: Standard; Device: SN65MLVD040RGZT; PackageDescription: QFN, 0.50mm Pitch, Square; 48 Pin, 7.00mm L X 7.00mm W X 1mm H body (W/Thermal Tab 4.2mm X 4.2mm), IPC Medium Density; Part Description: 4-Channel Half-Duplex M-LVDS Line Transceiver; Manufacturer Part Number: SN65MLVD040RGZT; Pin Count: 49; Case: QFN48; Mounted: Yes; Socket: No; SMD: Yes; Sense: No; ComponentHeight: 1mm; Author: CERN DEM JLC; HelpURL: \\cern.ch\dfs\Applications\Altium\Datasheets\SN65MLVD040RGZT.pdf; CreateDate: 17.03.2011; LatestRevisionDate: 17.03.2011
IC8 = 24AA02E48T-I/OT: 1.7V-5.5V, 2K I2C Serial EEPROM With EUI-48 Node Identity; Manufacturer: MICROCHIP TECHNOLOGY; PressFit: No; Bonding: No; Part Number: 24AA02E48T-I/OT; Component Kind: Standard; Component Type: Standard; Device: 24AA02E48T-I/OT; PackageDescription: SOT, 0.95mm pitch; 5 pin, 1.60mm W X 2.90mm L X 1.45mm H body, IPC Medium Density; Part Description: 1.7V-5.5V, 2K I2C Serial EEPROM With EUI-48 Node Identity; Manufacturer Part Number: 24AA02E48T-I/OT; Pin Count: 5; Case: SOT23-5; Mounted: Yes; Socket: No; SMD: Yes; Sense: No; ComponentHeight: 1.45mm; HelpURL: \\cern.ch\dfs\Applications\Altium\Datasheets\24AA02E48T-I-OT.pdf; Author: CERN DEM MR; CreateDate: 31.03.2016; LatestRevisionDate: 31.03.2016
IC20 = 24AA02E48-I/SN: 1.7V-5.5V, 2K I2C™ Serial EEPROMs with EUI-48™ Node Identity; Manufacturer: MICROCHIP TECHNOLOGY; PressFit: No; Bonding: No; Part Number: 24AA02E48-I/SN; Component Kind: Standard; Component Type: Standard; Device: 24AA02E48-I/SN; PackageDescription: SOIC, 1.27mm Pitch; 8 Pin - Body 4x5mm, IPC Medium Density; Part Description: 1.7V-5.5V, 2K I2C™ Serial EEPROMs with EUI-48™ Node Identity; Manufacturer Part Number: 24AA02E48-I/SN; Pin Count: 8; Case: SOIC8; Mounted: Yes; Socket: No; SMD: Yes; Sense: No; ComponentHeight: 1.75mm; HelpURL: \\cern.ch\dfs\Applications\Altium\Datasheets\24AA025E48-I-SN.pdf; Author: CERN DEM MR; CreateDate: 19.07.2016; LatestRevisionDate: 19.07.2016
J1 = 3M_N2530-6002RB: Connector 30 Male; Part Description: 30 Contacts - Straight .100'' x .100'' Low Profile Four-Wall Header, 2500 Series; Manufacturer: 3M; PressFit: No; Part Number: 3M_N2530-6002RB; Component Kind: Standard; Component Type: Standard; Pin Count: 30; Family: Header 30; Mounted: Yes; Socket: No; SMD: No; Sense: No; Status: None; Manufacturer Part Number: N2530-6002RB; ComponentHeight: 10.03mm; HelpURL: \\cern.ch\dfs\Applications\Altium\Datasheets\3M_N2530-6002RB.pdf; Author: CERN DEM JLC; CreateDate: 11.02.2009; LatestRevisionDate: 11.08.2009
R7#2 R9#2 R11 R13 R16 R21 R24 R35 = R0402_100R_1%_0.1W_100PPM: Resistor - 1%; Part Description: General Purpose Thick Film Chip Resistor; Manufacturer: GENERIC; Manufacturer Part Number: R0402_100R_1%_0.1W_100PPM_50V; Manufacturer1 Part Number: ERJ2RKF1000X; Power: 0.1W; TC: ±100ppm/°C; Voltage: 50V; Part Number: R0402_100R_1%_0.1W_100PPM; Component Kind: Standard; Component Type: Standard; Pin Count: 2; Value: 100; Status: Not recommended; Tolerance: ±1%; Case: 0402; Mounted: Yes; Sense: No; Socket: No; SMD: Yes; Manufacturer1 Example: PANASONIC; Manufacturer1 ComponentHeight: 0.4mm; HelpURL: \\cern.ch\dfs\Applications\Altium\Datasheets\R0402_PANASONIC_ERJ2RK.pdf; Author: CERN DEM JLC; CreateDate: 12.12.2013; LatestRevisionDate: 03.03.2015